# EAGLE design core_manual (EAGLE 9.6.2)
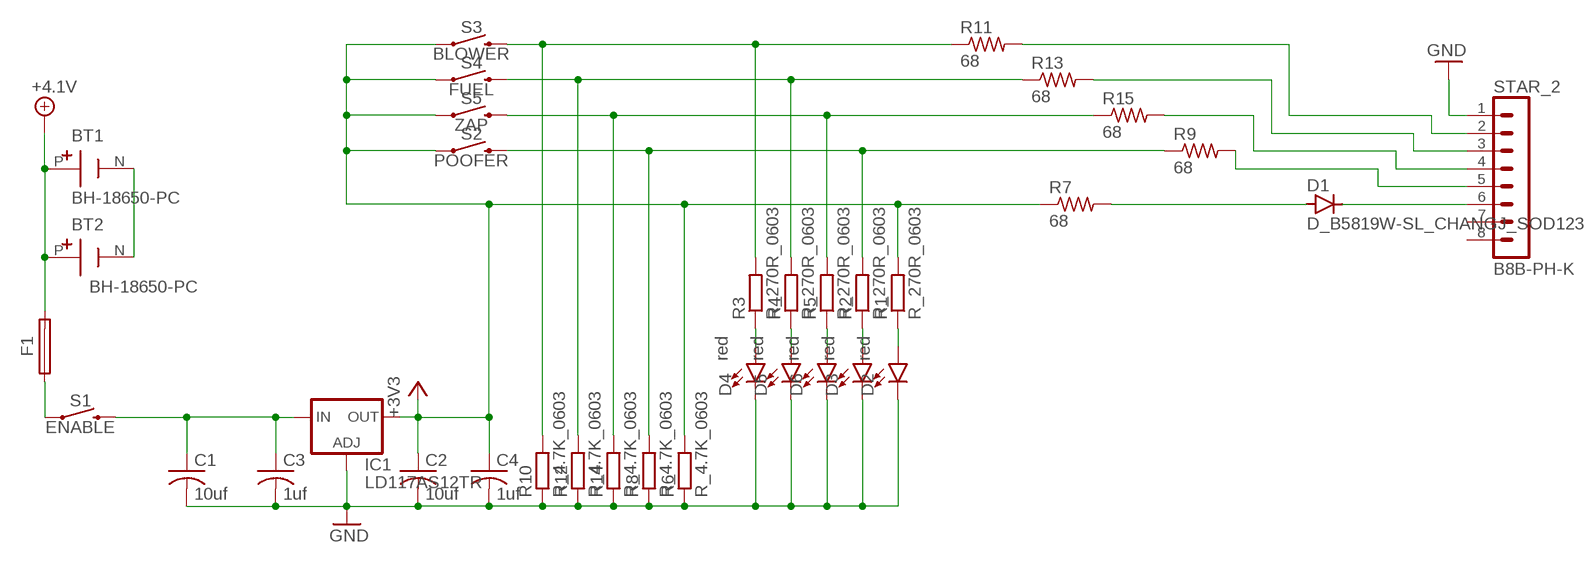
[diagram p0: schematic, sheet 1]

## Parts
BT1  BH-18650-PC  [BAT_BH-18650-PC]
BT2  BH-18650-PC  [BAT_BH-18650-PC]
C1  10uf  C-USC0603  [C0603]
C2  10uf  C-USC0603  [C0603]
C3  1uf  C-USC0805  [C0805]
C4  1uf  C-USC0805  [C0805]
D1  D_B5819W-SL_CHANGJ_SOD123  [SOD123]
D2  red  LED0603  [LED-0603]
D3  red  LED0603  [LED-0603]
D4  red  LED0603  [LED-0603]
D5  red  LED0603  [LED-0603]
D6  red  LED0603  [LED-0603]
F1  MF-MSMF-STYLE2_1  [FUSC4632X160]
IC1  LD117AS12TR  [SOT223]
R1  R_270R_0603  [R0603]
R2  R_270R_0603  [R0603]
R3  R_270R_0603  [R0603]
R4  R_270R_0603  [R0603]
R5  R_270R_0603  [R0603]
R6  R_4.7K_0603  [R0603]
R7  68  R-US_R0603  [R0603]
R8  R_4.7K_0603  [R0603]
R9  68  R-US_R0603  [R0603]
R10  R_4.7K_0603  [R0603]
R11  68  R-US_R0603  [R0603]
R12  R_4.7K_0603  [R0603]
R13  68  R-US_R0603  [R0603]
R14  R_4.7K_0603  [R0603]
R15  68  R-US_R0603  [R0603]
S1  ENABLE  MOMENTARY-SWITCH-SPST-PTH-6.0MM  [TACTILE_SWITCH_PTH_6.0MM]
S2  POOFER  MOMENTARY-SWITCH-SPST-PTH-6.0MM  [TACTILE_SWITCH_PTH_6.0MM]
S3  BLOWER  MOMENTARY-SWITCH-SPST-PTH-6.0MM  [TACTILE_SWITCH_PTH_6.0MM]
S4  FUEL  MOMENTARY-SWITCH-SPST-PTH-6.0MM  [TACTILE_SWITCH_PTH_6.0MM]
S5  ZAP  MOMENTARY-SWITCH-SPST-PTH-6.0MM  [TACTILE_SWITCH_PTH_6.0MM]
STAR_2  B8B-PH-K  [B8B-PH-K]

## Nets
+3V3: C2.1 C4.1 IC1.4(OUT) R1.2 R6.2 R7.1 S2.1 S3.1 S4.1 S5.1
+4.1V: BT1.P(+) BT2.P(+) F1.2
GND [GND]: C1.2 C2.2 C3.2 C4.2 D2.C D3.C D4.C D5.C D6.C IC1.1(ADJ) R6.1 R8.1 R10.1 R12.1 R14.1 STAR_2.1
N$1 [12V]: C1.1 C3.1 IC1.3(IN) S1.3
N$2: BT1.N(-) BT2.N(-)
N$3: F1.1 S1.1
N$4: R3.2 R10.2 R11.1 S3.3
N$5: R4.2 R12.2 R13.1 S4.3
N$6: R5.2 R14.2 R15.1 S5.3
N$7: R2.2 R8.2 R9.1 S2.3
N$8: R9.2 STAR_2.5
N$9: R15.2 STAR_2.4
N$10: R13.2 STAR_2.3
N$11: R11.2 STAR_2.2
N$12: D2.A R1.1
N$13: D3.A R2.1
N$14: D6.A R5.1
N$15: D5.A R4.1
N$16: D4.A R3.1
N$327: D1.A R7.2
N$328: D1.C STAR_2.6
Unconnected: STAR_2.7 STAR_2.8

## Library data of the parts
BT1 BT2 = BH-18650-PC:BH-18650-PC: Check availability <https://pricing.snapeda.com/parts/BH-18650-PC/MPD/view-part?ref=eda>; AVAILABILITY: In Stock; DESCRIPTION: BATTERY HOLDER 18650 PC PIN; MF: MPD; MP: BH-18650-PC; PACKAGE: None; PRICE: None; PURCHASE-URL: https://pricing.snapeda.com/search/part/BH-18650-PC/?ref=eda
C1 C2 = rcl:C-US: CAPACITOR, American symbol; LCSC_PART: C19702; SPICEPREFIX: C
C3 C4 = rcl:C-US: CAPACITOR, American symbol; LCSC_PART: C15849; SPICEPREFIX: C
D1 = JLC PCB Basic Parts_loc:D_: Diode; LCSC_DATASHEET: https://datasheet.lcsc.com/lcsc/1809140216_Changjiang-Electronics-Tech--CJ-B5819W-SL_C8598.pdf; LCSC_PART: C8598; LCSC_ROTATION_CCW: 180; LCSC_STOCK: 304161; PROPERTIES: 40V 600mV@1A 1A SOD-123 Schottky Barrier Diodes (SBD) ROHS
D2-D6 = SparkFun-LED:LED: LED (Generic) Standard schematic elements and footprints for 5mm, 3mm, 1206, and 0603 sized LEDs. Generic LEDs with no color specified.; LCSC_PART: C2286
F1 = Fuse:MF-MSMF: PTC Resettable Fuses Datasheet <https://www.bourns.com/docs/Product-Datasheets/mfmsmf.pdf?sfvrsn=26>; CATEGORY: FUSE; DESCRIPTION: PTC Resettable Fuses; LCSC_PART: C78695; MANUFACTURER: BOURNS; MPN: MF-MSMF; OPERATING_TEMPERATURE: -40 °C to +85 °C; PART_STATUS: Active; ROHS_COMPLIANCE: RoHS Compliant; SERIES: MF-MSMF; SUB-CATEGORY: Resettable; TYPE: PTC
IC1 = v-reg:LD117A?*: Low drop fixed and adjustable positive voltage regulators 1 A Source: http://www.st.com/stonline/products/literature/ds/7194/ld1117axx.pdf; LCSC_PART: C347222; PRICE: 0.5
R1-R5 = JLC PCB Basic Parts_loc:R_: Resistor General purpose SMD Resistor; LCSC_DATASHEET: https://datasheet.lcsc.com/lcsc/2110252130_UNI-ROYAL-Uniroyal-Elec-0603WAF2700T5E_C22966.pdf; LCSC_PART: C22966; LCSC_ROTATION_CCW: 0; LCSC_STOCK: 315292; PROPERTIES: ±1% 1/10W Thick Film Resistors 75V ±100ppm -55°C~+155°C 270Ohm 0603 ROHS
R6 R8 R10 R12 R14 = JLC PCB Basic Parts_loc:R_: Resistor General purpose SMD Resistor; LCSC_DATASHEET: https://datasheet.lcsc.com/lcsc/2110252130_UNI-ROYAL-Uniroyal-Elec-0603WAF4701T5E_C23162.pdf; LCSC_PART: C23162; LCSC_ROTATION_CCW: 0; LCSC_STOCK: 3103173; PROPERTIES: ±1% 1/10W Thick Film Resistors 75V ±100ppm -55°C~+155°C 4.7kOhm 0603 ROHS
R7 R9 R11 R13 R15 = rcl:R-US_: RESISTOR, American symbol; LCSC_PART: c27592; SPICEPREFIX: R
S1-S5 = SparkFun-Switches:MOMENTARY-SWITCH-SPST: Momentary Switch (Pushbutton) - SPST Normally-open (NO) SPST momentary switches (buttons, pushbuttons). Variants PTH-12MM - 12mm square, through-hole Momentary Pushbutton Switch - 12mm Square <https://www.sparkfun.com/products/9190> (COM-09190) PTH-6.0MM, PTH-6.0MM-KIT - 6.0mm square, through-hole Mini Pushbutton Switch <https://www.sparkfun.com/products/97> (COM-00097) KIT package intended for soldering kit's - only one side of pads' copper is exposed. PTH-RIGHT-ANGLE-KIT - Right-angle, through-hole Right Angle Tactile Button <https://www.sparkfun.com/products/10791> - Used on SparkFun BigTime Watch Kit <https://www.sparkfun.com/products/11734> SMD-12MM - 12mm square, surface-mount Tactile Button - SMD (12mm) <https://www.sparkfun.com/products/12993> (COM-12993) Used on SparkFun PicoBoard <https://www.sparkfun.com/products/11888> SMD-4.5MM - 4.5mm Square Trackball Switch Used on SparkFun Blackberry Trackballer Breakout <https://www.sparkfun.com/products/13169> SMD-4.6MMX2.8MM - 4.60mm x 2.80mm, surface mount Used on SparkFun SAMD21 Mini Breakout <https://www.sparkfun.com/products/13664> SMD-5.2MM, SMD-5.2-REDUNDANT - 5.2mm square, surface-mount Mini Pushbutton Switch - SMD <https://www.sparkfun.com/products/8720> (COM-08720) Used on Arduino Pro Mini <https://www.sparkfun.com/products/11114> REDUNDANT package connects both switch circuits together SMD-6.0X3.5MM - 6.0 x 3.5mm, surface mount Momentary Reset Switch SMD <https://www.sparkfun.com/products/8229> (COM-08229) SMD-6.2MM-TALL - 6.2mm square, surface mount Tactile Button - SMD (6mm) <https://www.sparkfun.com/products/12992> Used on SparkFun Digital Sandbox <https://www.sparkfun.com/products/12651> SMD-RIGHT-ANGLE - Right-angle, surface mount Used on SparkFun Block for Intel® Edison - Arduino <https://www.sparkfun.com/products/13036>; PROD_ID: SWCH-08441; SF_SKU: COM-00097
STAR_2 = con-jst-ph:B8B-PH-K: HEADER

## Net classes
0 default: width 0.305 mm, clearance 0.305 mm
1 GND: width 0.356 mm, clearance 0.305 mm
2 12V: width 0.305 mm, clearance 0.305 mm
4 3V3: width 0.305 mm, clearance 0.305 mm

## Board
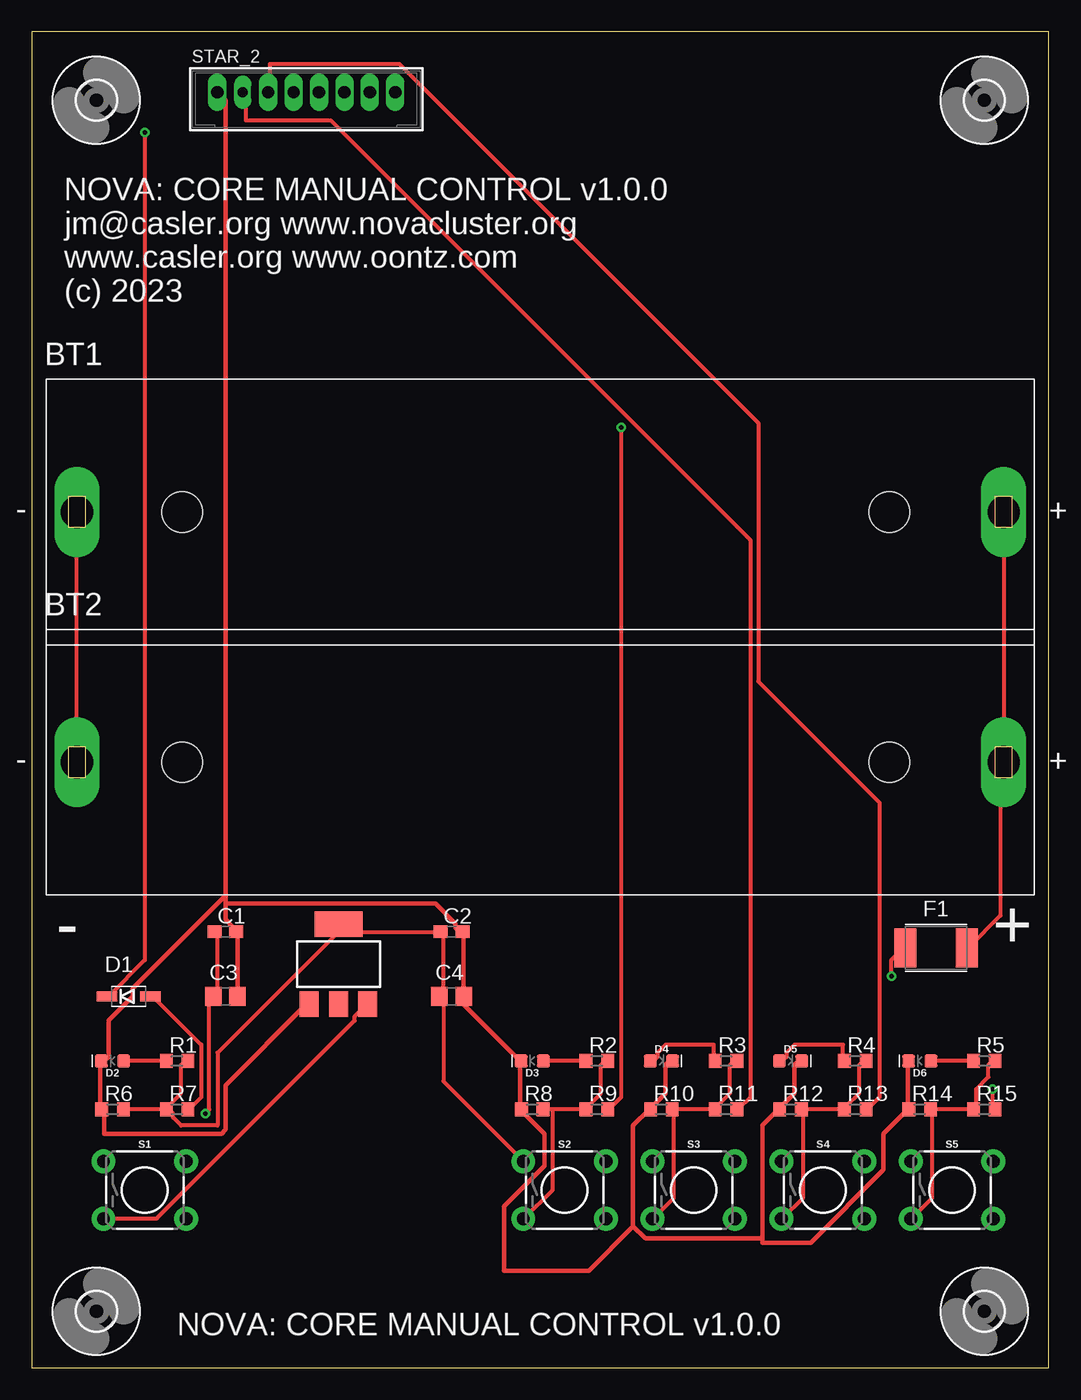
[diagram p1: board, top side]
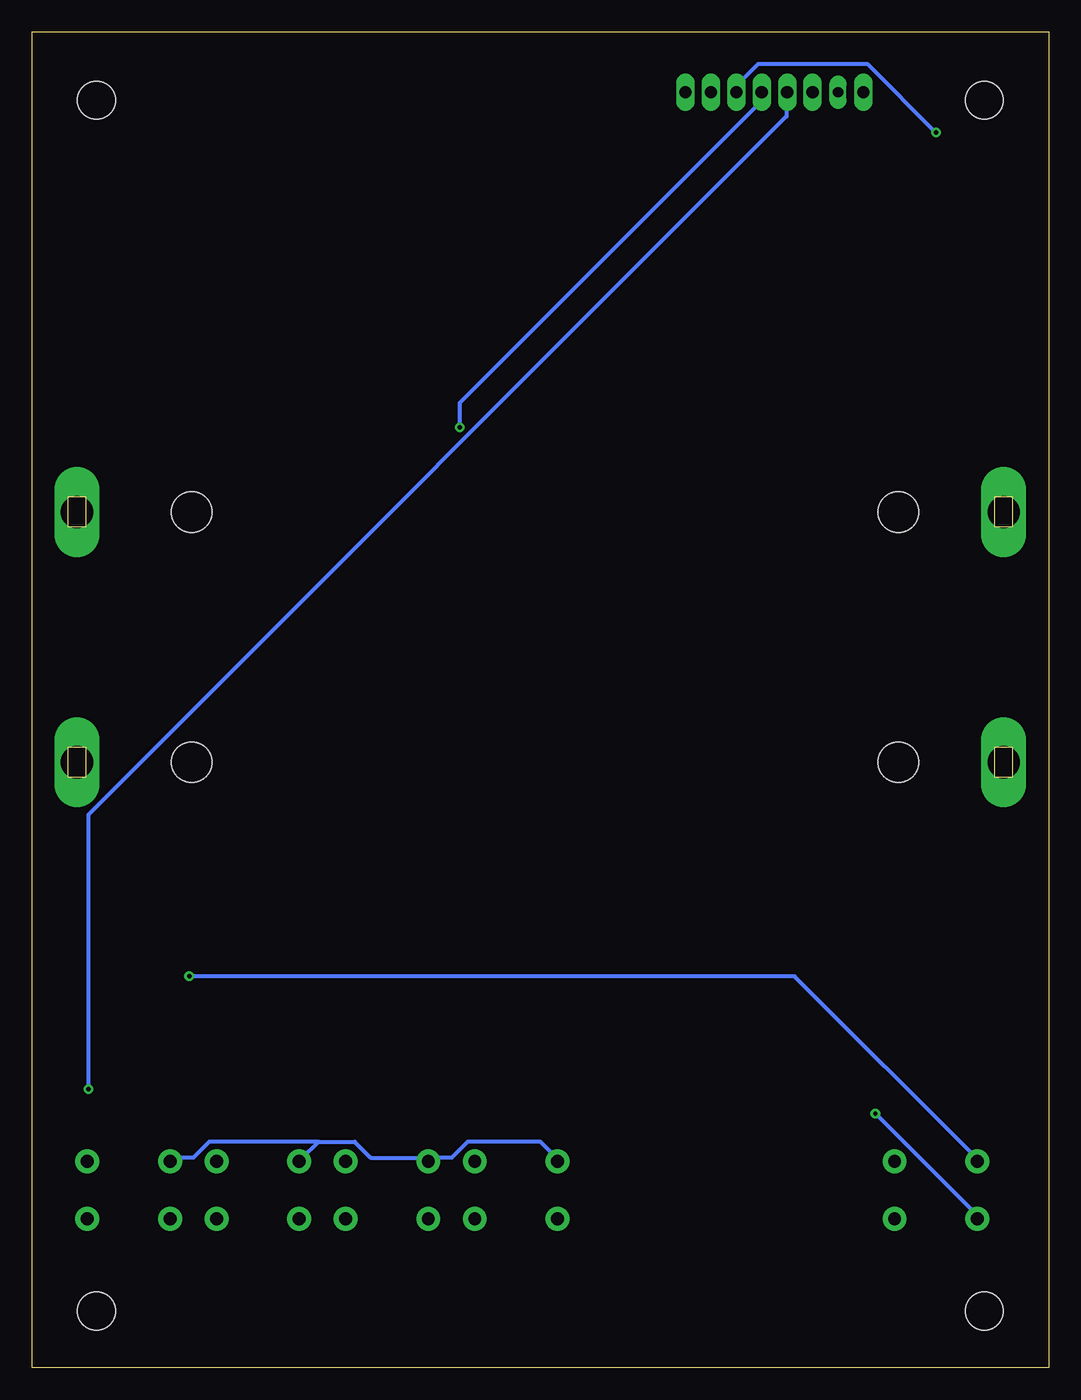
[diagram p2: board, bottom side, seen from below]

Size 79.99 x 105.08 mm. Coordinates in mm from the lower left corner, seen from the top.
Outline: 0,0 79.99,0 79.99,105.08 0,105.08 0,0
Copper layers (1*16): Top 0.035mm / dielectric 1.5mm / Bottom 0.035mm
Design rules "default": minimum track width 6mil, minimum drill 0.35mm, track to track 6mil, track to pad 6mil, pad to pad 6mil, via to via 6mil, smd to smd 6mil, copper to edge 40mil, drill to drill 6mil, minimum pad ring 10mil, minimum via ring 8mil, stop-mask expansion 4mil, vias tented up to drill 0mil, thermal gap 10mil

### Footprints (pad centres in the part's own frame; a part is rotated, then mirrored left to right if it is on the bottom)
BAT_BH-18650-PC = drill 2.54 pad 3.44 long: N -36.45,0; P 36.45,0 | hole 3.2: -28.17,0; 27.44,0
C0603 = smd 1.1 x 1: 1 -0.85,0; 2 0.85,0
C0805 = smd 1.3 x 1.5: 1 -0.95,0; 2 0.95,0
SOD123 = smd 1.6 x 0.8: A 1.7,0; C -1.7,0
LED-0603 = smd 1 x 1: A -0.877,0; C 0.877,0
FUSC4632X160 = smd 1.73 x 3.05: 1 -2.415,0; 2 2.415,0
3,0 = hole 3: 0,0
SOT223 = smd 1.5 x 2: 1 -2.3,-3.15; 2 0,-3.15; 3 2.3,-3.15 | smd 3.8 x 2: 4 0,3.15
R0603 = smd 1 x 1.1: 1 -0.85,0; 2 0.85,0
TACTILE_SWITCH_PTH_6.0MM = drill 1.016 pad 1.88: 1 -3.251,2.261; 2 3.251,2.261; 3 -3.251,-2.261; 4 3.251,-2.261
B8B-PH-K = drill 0.965 long: 1 -7,0; 3 -3,0; 4 -1,0; 5 1,0; 6 3,0; 7 5,0; 8 7,0 | drill 0.813 long: 2 -5,0

### Placement (x,y rotation side)
BT1  40.01,67.31 0 top
BT2  40.01,47.62 0 top
C1  15.24,34.29 0 top
C2  33.02,34.29 0 top
C3  15.24,29.21 0 top
C4  33.02,29.21 0 top
D1  7.62,29.21 0 top
D2  6.35,24.13 180 top
D3  39.37,24.13 180 top
D4  49.53,24.13 0 top
D5  59.69,24.13 0 top
D6  69.85,24.13 180 top
F1  71.12,33.02 0 top
H1  MOUNT-HOLE3.0  [3,0]  5.08,99.69 0 top
H2  MOUNT-HOLE3.0  [3,0]  74.93,99.69 0 top
H3  MOUNT-HOLE3.0  [3,0]  5.08,4.45 0 top
H4  MOUNT-HOLE3.0  [3,0]  74.93,4.45 0 top
IC1  24.13,31.75 0 top
R1  11.43,24.13 0 top
R2  44.45,24.13 0 top
R3  54.61,24.13 0 top
R4  64.77,24.13 0 top
R5  74.93,24.13 0 top
R6  6.35,20.32 0 top
R7  11.43,20.32 0 top
R8  39.37,20.32 0 top
R9  44.45,20.32 0 top
R10  49.53,20.32 0 top
R11  54.61,20.32 0 top
R12  59.69,20.32 0 top
R13  64.77,20.32 0 top
R14  69.85,20.32 0 top
R15  74.93,20.32 0 top
S1  8.89,13.97 0 top
S2  41.91,13.97 0 top
S3  52.07,13.97 0 top
S4  62.23,13.97 0 top
S5  72.39,13.97 0 top
STAR_2  21.59,100.33 0 top

### Tracks (layer width: path | path; a pad name or v marks a point on that pad's centre or on a via)
+3V3
  Top 0.305: R6.2 R7.1 10.79,20.32 | 10.79,20.32 10.79,20.64 11.75,21.59 11.75,23.81 12.06,24.13 R1.2 | 32.38,29.21 32.38,34.29 C2.1 24.13,34.29 | 24.13,34.29 IC1.4 24.13,34.61 | 32.38,29.21 32.38,22.54 38.42,16.51 S2.1 | 32.38,29.21 C4.1 | 10.79,20.32 11.11,20 11.11,19.68 11.75,19.05 14.61,19.05 14.61,24.77 24.13,34.29
  Bottom 0.305: 57.47,17.78 54.61,17.78 53.34,16.51 48.9,16.51 S3.1 48.58,16.51 46.99,16.51 45.72,17.78 40.01,17.78 38.73,16.51 S2.1 | 57.47,17.78 58.74,16.51 S4.1 | 57.47,17.78 66.04,17.78 67.31,16.51 68.9,16.51 S5.1
+4.1V
  Top 0.305: F1.2 73.66,33.02 76.2,35.56 76.2,47.62 BT2.P 76.52,47.62 76.52,67.31 BT1.P
GND
  Top 0.356: D4.C 50.16,24.13 49.85,23.81 49.85,21.59 48.9,20.64 48.9,20.32 R10.1 48.58,20.32 47.31,19.05 47.31,11.11 | 68.9,20.32 68.9,24.13 D6.C | D5.C 60.33,24.13 60.01,23.81 60.01,21.59 59.05,20.64 59.05,20.32 R12.1 58.74,20.32 57.47,19.05 57.47,10.16 | 68.9,20.32 66.99,18.41 66.99,15.56 61.28,9.84 57.47,9.84 57.47,10.16 | 68.9,20.32 R14.1 | 47.31,11.11 48.26,10.16 57.47,10.16 | IC1.1 21.59,28.57 15.24,22.23 15.24,18.73 14.92,18.41 5.71,18.41 5.71,20.32 R6.1 5.4,20.32 5.4,24.13 D2.C 5.71,24.13 6.03,24.45 6.03,27.3 7.94,29.21 7.94,29.84 15.24,37.15 | 38.42,24.13 38.42,20.32 R8.1 38.73,20.32 38.73,20 40.32,18.41 40.32,15.88 37.15,12.7 37.15,7.62 43.81,7.62 47.31,11.11 | C4.2 33.97,34.29 C2.2 33.66,34.29 33.34,34.61 33.34,34.92 31.75,36.51 15.24,36.51 | 38.42,24.13 33.97,28.57 C4.2 | 38.42,24.13 D3.C | C4.2 | C3.2 16.19,34.29 C1.2 15.88,34.29 15.88,34.61 15.24,35.24 15.24,36.51 | 15.24,36.51 15.24,37.15 | 15.24,37.15 15.24,99.69 14.61,100.33 STAR_2.1
N$1  (via drill 0.35)
  Top 0.305: C1.1 14.61,34.29 14.61,29.21 C3.1 13.97,28.89 13.97,20.32 v13.65,20 | IC1.3 26.35,28.57 25.4,27.62 25.4,27.3 9.84,11.75 5.71,11.75 S1.3
  Bottom 0.305: v13.65,20 5.4,11.75 S1.3
N$2
  Top 0.305: BT2.N 3.49,47.62 3.49,67.31 BT1.N
N$3  (via drill 0.35)
  Top 0.305: v67.63,30.8 67.63,32.07 68.58,33.02 F1.1
  Bottom 0.305: v67.63,30.8 20,30.8 5.71,16.51 S1.1
N$4
  Top 0.305: 50.48,20.32 R11.1 53.98,20.32 53.98,20.64 54.93,21.59 54.93,23.81 55.24,24.13 R3.2 | 50.48,20.32 50.48,13.34 48.9,11.75 S3.3 | 50.48,20.32 R10.2
N$5
  Top 0.305: 60.64,20.32 R13.1 64.14,20.32 64.14,20.64 65.09,21.59 65.09,23.81 65.41,24.13 R4.2 | 60.64,20.32 60.64,13.34 59.05,11.75 S4.3 | 60.64,20.32 R12.2
N$6
  Top 0.305: 70.8,20.32 R15.1 74.3,20.32 74.3,21.91 75.25,22.86 75.25,23.81 75.56,24.13 R5.2 | 70.8,20.32 70.8,13.34 69.22,11.75 S5.3 | 70.8,20.32 R14.2
N$7
  Top 0.305: 40.96,20.32 R9.1 43.81,20.32 43.81,20.64 44.77,21.59 44.77,23.81 45.09,24.13 R2.2 | 40.96,20.32 R8.2 | 40.96,20.32 40.96,13.97 38.73,11.75 S2.3
N$8  (via drill 0.35)
  Top 0.305: v46.35,73.98 46.35,21.27 45.4,20.32 R9.2
  Bottom 0.305: v46.35,73.98 46.35,75.88 22.86,99.38 22.86,100.33 STAR_2.5
N$9  (via drill 0.35)
  Top 0.305: v75.56,21.91 75.56,20.32 R15.2
  Bottom 0.305: v75.56,21.91 75.56,43.5 20.64,98.42 20.64,100.33 STAR_2.4
N$10
  Top 0.305: R13.2 65.72,20.32 66.67,21.27 66.67,44.45 57.15,53.98 57.15,74.3 28.89,102.55 18.73,102.55 18.73,100.33 STAR_2.3
N$11
  Top 0.305: R11.2 55.56,20.32 56.52,21.27 56.52,65.09 23.5,98.11 16.83,98.11 16.83,100.33 STAR_2.2
N$12
  Top 0.305: R1.1 D2.A
N$13
  Top 0.305: R2.1 D3.A
N$14
  Top 0.305: R5.1 D6.A
N$15
  Top 0.305: D5.A 59.05,24.13 59.37,24.45 59.37,24.77 60.01,25.4 63.82,25.4 63.82,24.13 R4.1
N$16
  Top 0.305: D4.A 48.9,24.13 49.21,24.45 49.21,24.77 49.85,25.4 53.66,25.4 53.66,24.13 R3.1
N$327
  Top 0.305: R7.2 12.38,20.32 13.34,21.27 13.34,25.4 9.53,29.21 D1.A
N$328  (via drill 0.35)
  Top 0.305: v8.89,97.16 8.89,32.07 6.03,29.21 D1.C
  Bottom 0.305: v8.89,97.16 14.29,102.55 22.86,102.55 24.45,100.97 24.45,100.33 STAR_2.6

### Text on the board
tPlace: NOVA: CORE MANUAL CONTROL v1.0.0 / jm@casler.org www.novacluster.org / www.casler.org www.oontz.com / (c) 2023 | - | + | NOVA: CORE MANUAL CONTROL v1.0.0